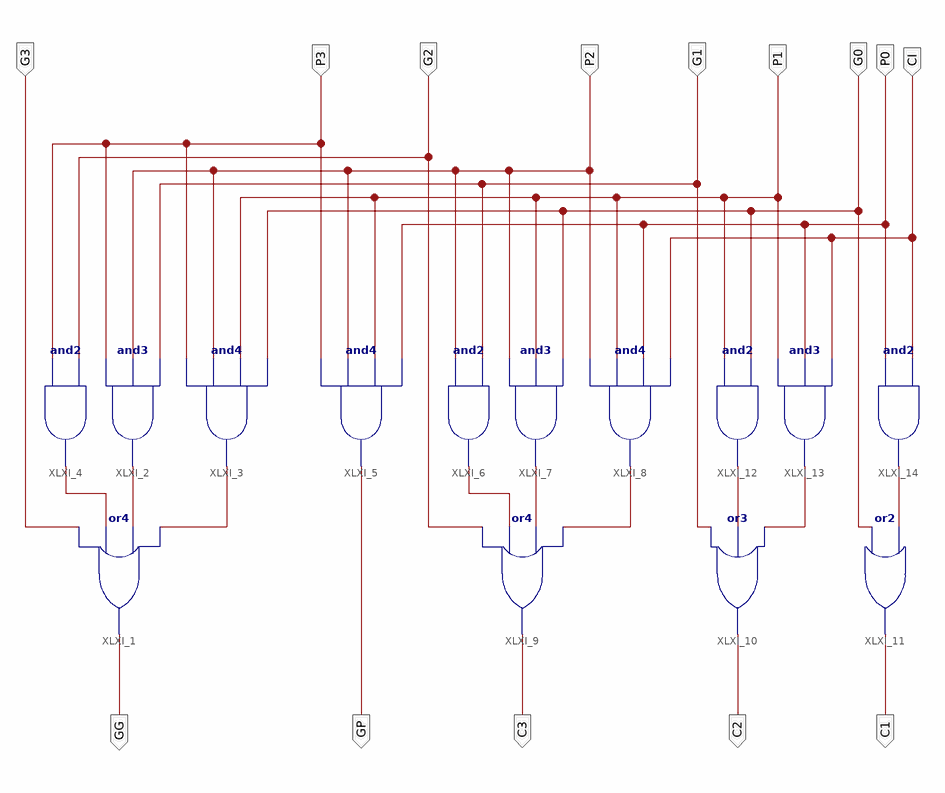
[diagram p0: schematic sheet 1]
// Xilinx ISE schematic CLA.sch (kintex7) as structural Verilog: 14 symbols, 14 ports
module CLA (
  input  CI,
  input  P0,
  input  P1,
  input  P2,
  input  P3,
  input  G0,
  input  G1,
  input  G2,
  input  G3,
  output GP,
  output GG,
  output C3,
  output C2,
  output C1
);

  wire XLXN_16, XLXN_17, XLXN_18, XLXN_24, XLXN_25, XLXN_26, XLXN_27, XLXN_28, XLXN_29;

  or XLXI_1 (GG, G3, XLXN_16, XLXN_17, XLXN_18);
  and XLXI_2 (XLXN_17, P3, P2, G1);
  and XLXI_3 (XLXN_18, P3, P2, P1, G0);
  and XLXI_4 (XLXN_16, P3, G2);
  and XLXI_5 (GP, P3, P2, P1, P0);
  and XLXI_6 (XLXN_25, P2, G1);
  and XLXI_7 (XLXN_24, P2, P1, G0);
  and XLXI_8 (XLXN_26, P2, P1, P0, CI);
  or XLXI_9 (C3, G2, XLXN_25, XLXN_24, XLXN_26);
  or XLXI_10 (C2, G1, XLXN_27, XLXN_28);
  or XLXI_11 (C1, G0, XLXN_29);
  and XLXI_12 (XLXN_27, P1, G0);
  and XLXI_13 (XLXN_28, P1, P0, CI);
  and XLXI_14 (XLXN_29, P0, CI);
endmodule
